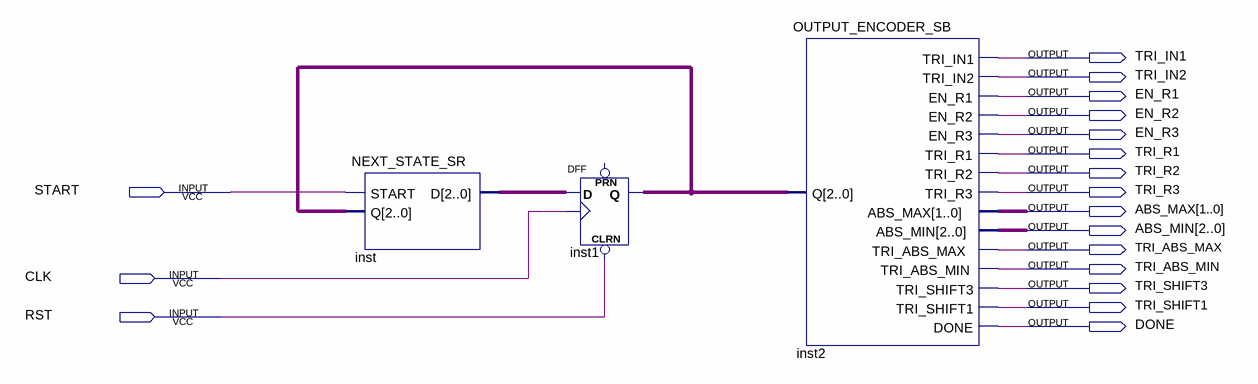
[diagram p0: schematic sheet]
// Quartus schematic CONTROLER_SB.bdf as structural Verilog: 3 symbols, 18 pins
module CONTROLER_SB (
  input  START,
  input  CLK,
  input  RST,
  output TRI_IN1,
  output TRI_IN2,
  output EN_R1,
  output EN_R2,
  output EN_R3,
  output TRI_R1,
  output TRI_R2,
  output TRI_R3,
  output [1:0] ABS_MAX,
  output [2:0] ABS_MIN,
  output TRI_ABS_MAX,
  output TRI_ABS_MIN,
  output TRI_SHIFT3,
  output TRI_SHIFT1,
  output DONE
);

  wire [2:0] inst1_q, inst_d;

  NEXT_STATE_SR inst (.START(START), .Q(inst1_q), .D(inst_d));
  DFF inst1[2:0] (.CLRN(RST), .CLK(CLK), .D(inst_d), .Q(inst1_q));  // open: PRN
  OUTPUT_ENCODER_SB inst2 (
    .Q(inst1_q), .TRI_IN1(TRI_IN1), .TRI_IN2(TRI_IN2), .EN_R1(EN_R1), .EN_R2(EN_R2), .EN_R3(EN_R3),
    .TRI_R1(TRI_R1), .TRI_R2(TRI_R2), .TRI_R3(TRI_R3), .ABS_MAX(ABS_MAX), .ABS_MIN(ABS_MIN),
    .TRI_ABS_MAX(TRI_ABS_MAX), .TRI_ABS_MIN(TRI_ABS_MIN), .TRI_SHIFT3(TRI_SHIFT3), .TRI_SHIFT1(TRI_SHIFT1),
    .DONE(DONE));
endmodule
